# EAGLE design Main Board (EAGLE 9.3.1)
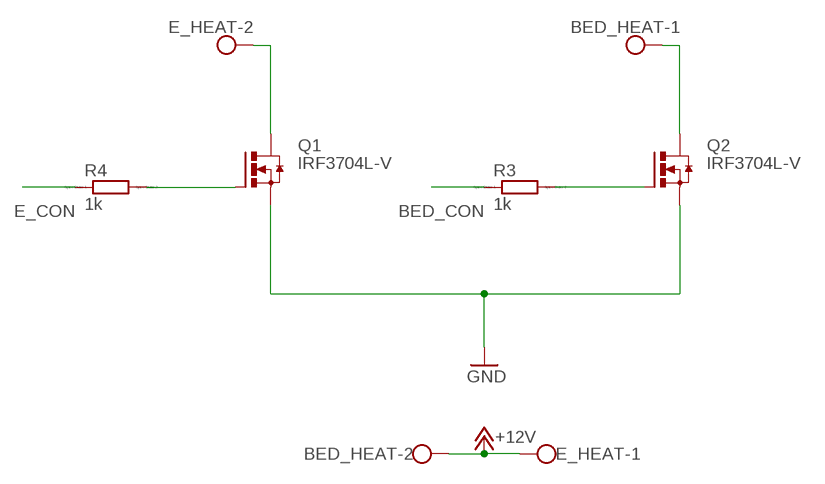
[diagram p0: schematic, sheet 1, part 1 of 2]
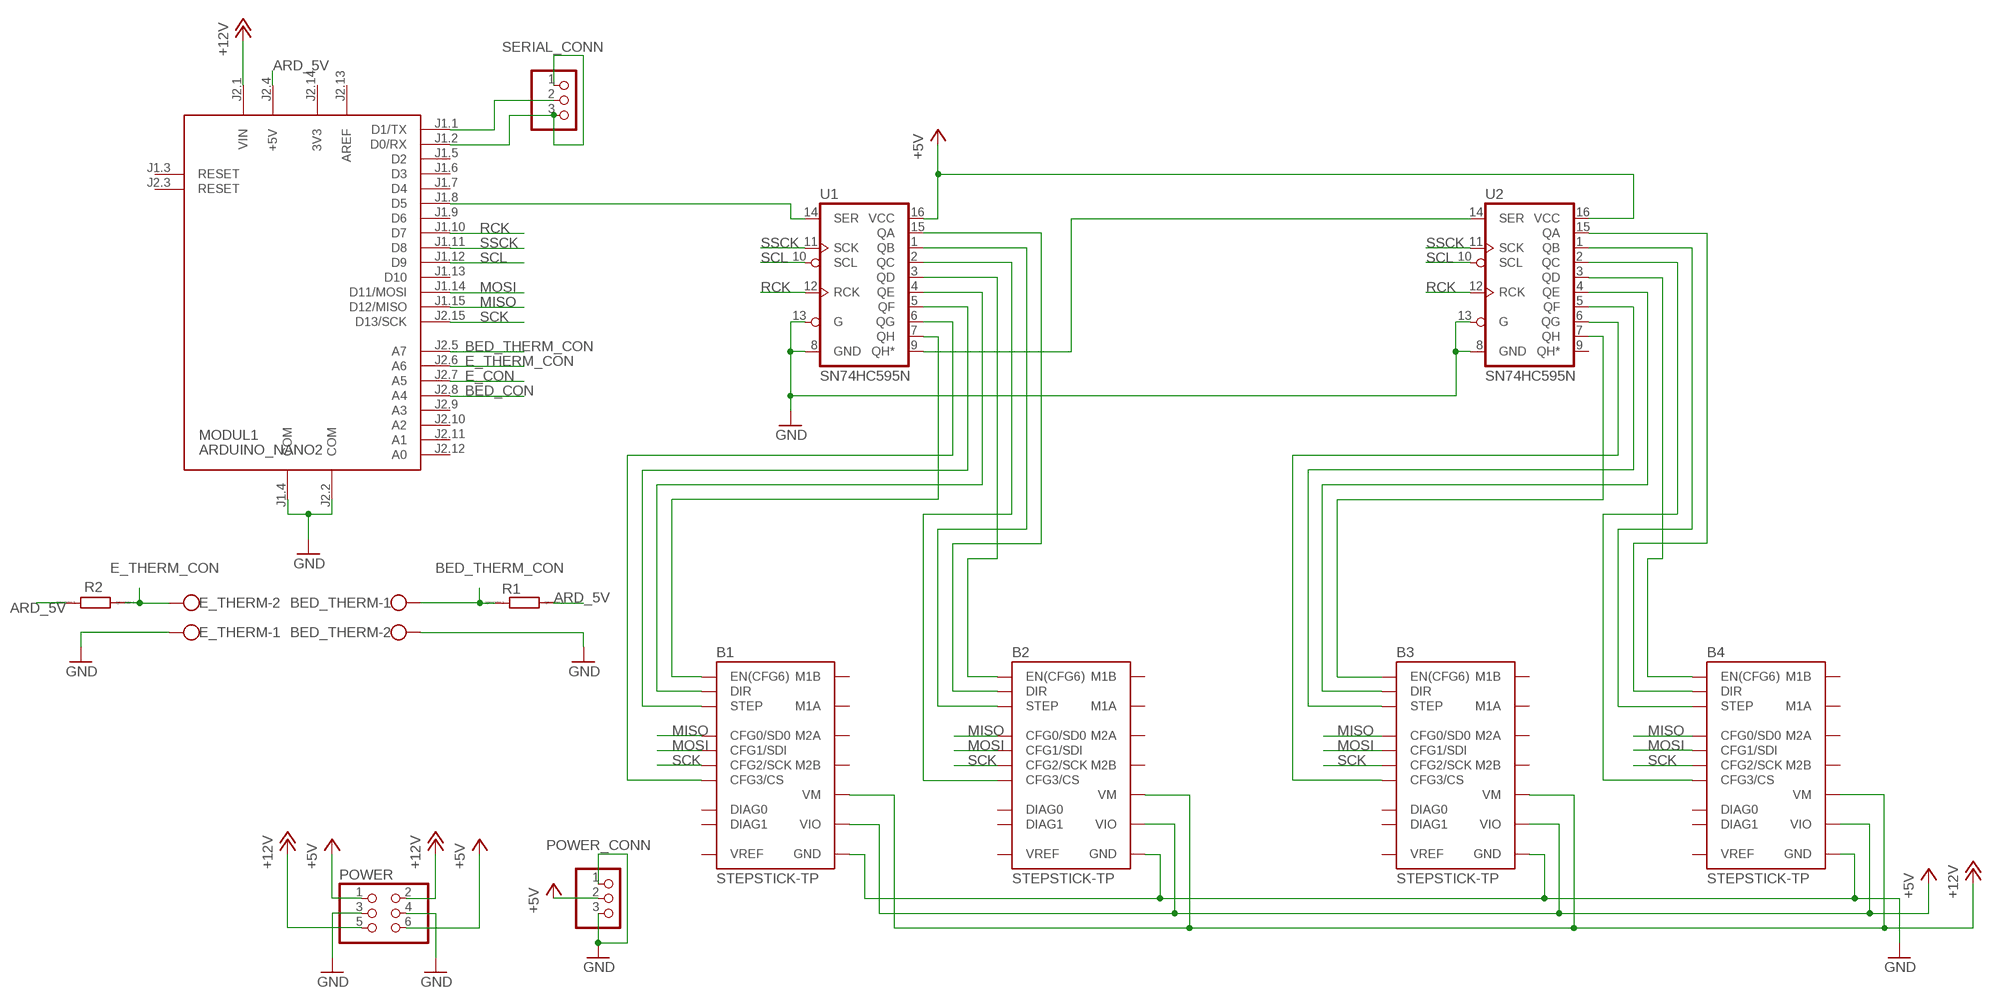
[diagram p1: schematic, sheet 1, part 2 of 2]

## Parts
B1  STEPSTICK-TP  [STEPSTICK_TP]
B2  STEPSTICK-TP  [STEPSTICK_TP]
B3  STEPSTICK-TP  [STEPSTICK_TP]
B4  STEPSTICK-TP  [STEPSTICK_TP]
BED_HEAT  W237-102  [W237-102]
BED_THERM  W237-102  [W237-102]
E_HEAT  W237-102  [W237-102]
E_THERM  W237-102  [W237-102]
MODUL1  ARDUINO_NANO2  [ARDUINO_NANO2]
POWER  PINHD-2X3  [2X03]
POWER_CONN  PINHD-1X3  [1X03]
Q1  IRF3704L-V  [TO262-V]
Q2  IRF3704L-V  [TO262-V]
R1  R0204/7  [0204/7]
R2  R0204/7  [0204/7]
R3  1k  R0207/10  [0207/10]
R4  1k  R0207/10  [0207/10]
SERIAL_CONN  PINHD-1X3  [1X03]
U1  SN74HC595N  74HC595N  [DIP16]
U2  SN74HC595N  74HC595N  [DIP16]

## Nets
+5V: B1.VIO B2.VIO B3.VIO B4.VIO POWER.1 POWER.6 POWER_CONN.2 U1.16(VCC) U2.16(VCC)
+12V: B1.VM B2.VM B3.VM B4.VM BED_HEAT.2 E_HEAT.1 MODUL1.J2.1(VIN) POWER.2 POWER.5
ARD_5V: MODUL1.J2.4(+5V) R1.2 R2.2
BED_CON: MODUL1.J2.8(A4) R3.1
BED_THERM_CON: BED_THERM.1 MODUL1.J2.5(A7) R1.1
E_CON: MODUL1.J2.7(A5) R4.1
E_THERM_CON: E_THERM.2 MODUL1.J2.6(A6) R2.1
GND: B1.GND@1(GND) B1.GND@2(GND) B2.GND@1(GND) B2.GND@2(GND) B3.GND@1(GND) B3.GND@2(GND) B4.GND@1(GND) B4.GND@2(GND) BED_THERM.2 E_THERM.1 MODUL1.J1.4(COM) MODUL1.J2.2(COM) POWER.3 POWER.4 POWER_CONN.1 POWER_CONN.3 Q1.3(S) Q2.3(S) U1.8(GND) U1.13(G) U2.8(GND) U2.13(G)
MISO: B1.NC/CFG0(CFG0/SD0) B2.NC/CFG0(CFG0/SD0) B3.NC/CFG0(CFG0/SD0) B4.NC/CFG0(CFG0/SD0) MODUL1.J1.15(D12/MISO)
MOSI: B1.CFG1(CFG1/SDI) B2.CFG1(CFG1/SDI) B3.CFG1(CFG1/SDI) B4.CFG1(CFG1/SDI) MODUL1.J1.14(D11/MOSI)
N$1 [Data]: MODUL1.J1.1(D1/TX) SERIAL_CONN.2
N$2: U1.9(QH*) U2.14(SER)
N$3: B2.CFG3(CFG3/CS) U1.2(QC)
N$4: E_HEAT.2 Q1.2(D)
N$5: Q2.1(G) R3.2
N$6: BED_HEAT.1 Q2.2(D)
N$7: Q1.1(G) R4.2
N$11: B3.EN(EN(CFG6)) U2.7(QH)
N$13: B3.STEP U2.5(QF)
N$15: B3.CFG3(CFG3/CS) U2.6(QG)
N$16: B4.CFG3(CFG3/CS) U2.2(QC)
N$18: B4.DIR U2.15(QA)
N$20: B1.DIR U1.4(QE)
N$21: B1.STEP U1.5(QF)
N$22 [Data]: MODUL1.J1.8(D5) U1.14(SER)
N$23: B1.CFG3(CFG3/CS) U1.6(QG)
N$24: B2.STEP U1.1(QB)
N$25: B2.DIR U1.15(QA)
N$26: B2.EN(EN(CFG6)) U1.3(QD)
N$27 [Data]: MODUL1.J1.2(D0/RX) SERIAL_CONN.1 SERIAL_CONN.3
N$28 [Data]: B1.EN(EN(CFG6)) U1.7(QH)
N$30: B3.DIR U2.4(QE)
N$33: B4.EN(EN(CFG6)) U2.3(QD)
N$35: B4.STEP U2.1(QB)
RCK: MODUL1.J1.10(D7) U1.12(RCK) U2.12(RCK)
SCK: B1.CFG2(CFG2/SCK) B2.CFG2(CFG2/SCK) B3.CFG2(CFG2/SCK) B4.CFG2(CFG2/SCK) MODUL1.J2.15(D13/SCK)
SCL: MODUL1.J1.12(D9) U1.10(SCL) U2.10(SCL)
SSCK: MODUL1.J1.11(D8) U1.11(SCK) U2.11(SCK)
Unconnected: B1.DIAG0 B1.DIAG1 B1.M1A B1.M1B B1.M2A B1.M2B B1.VREF B2.DIAG0 B2.DIAG1 B2.M1A B2.M1B B2.M2A B2.M2B B2.VREF B3.DIAG0 B3.DIAG1 B3.M1A B3.M1B B3.M2A B3.M2B B3.VREF B4.DIAG0 B4.DIAG1 B4.M1A B4.M1B B4.M2A B4.M2B B4.VREF MODUL1.J1.3(RESET) MODUL1.J1.5(D2) MODUL1.J1.6(D3) MODUL1.J1.7(D4) MODUL1.J1.9(D6) MODUL1.J1.13(D10) MODUL1.J2.3(RESET) MODUL1.J2.9(A3) MODUL1.J2.10(A2) MODUL1.J2.11(A1) MODUL1.J2.12(A0) U2.9(QH*)

## Power pins joined to a net without a drawn wire
3V3: MODUL1.J2.14(3V3)
AREF: MODUL1.J2.13(AREF)

## Library data of the parts
B1-B4 = we-board:STEPSTICK: SilentStepStick - Trinamic TMC2100/TMC2130 Stepper Motor Driver TMC2100 - CFG pins for configuration TMC2130 - SPI for configuration Pin CFG0/SDO only available on TMC2130 SilentStepStick.
BED_HEAT BED_THERM E_HEAT E_THERM = con-wago-500:W237-102: WAGO SCREW CLAMP; MPN: 237-102; OC_FARNELL: unknown; OC_NEWARK: 70K9898
MODUL1 = arduinoNano:ARDUINO_NANO2: Arduino Nano2 Auto generated by modulcreator.ulp \;; ANZAHL: 2; MODUL: TRUE; STECKX0: -76200; STECKX1: 76200; STECKY0: 177800; STECKY1: 177800
POWER = pinhead:PINHD-2X3: PIN HEADER
POWER_CONN SERIAL_CONN = pinhead:PINHD-1X3: PIN HEADER
Q1 Q2 = transistor-power:IRF3704: SMPS MOSFET HEXFET® Power MOSFET Source: http://www.irf.com/product-info/datasheets/data/irf3704.pdf
R1-R4 = eagle-ltspice:R: RESISTOR, European symbol; SPICEMODEL: NONE; SPICEPREFIX: R
U1 U2 = SparkFun-IC-Logic:74*595: 8-Bit Shift Register (Serial to Parallel) Datasheet <http://cdn.sparkfun.com/datasheets/BreakoutBoards/MM74HC595.pdf> SparkFun Products SparkFun Shift Register Breakout - 74HC595 <https://www.sparkfun.com/products/10680> (BOB-10680); PROD_ID: IC-13123

## Net classes
0 default: width 0.254 mm
1 Data: width 0.025 mm

## Board
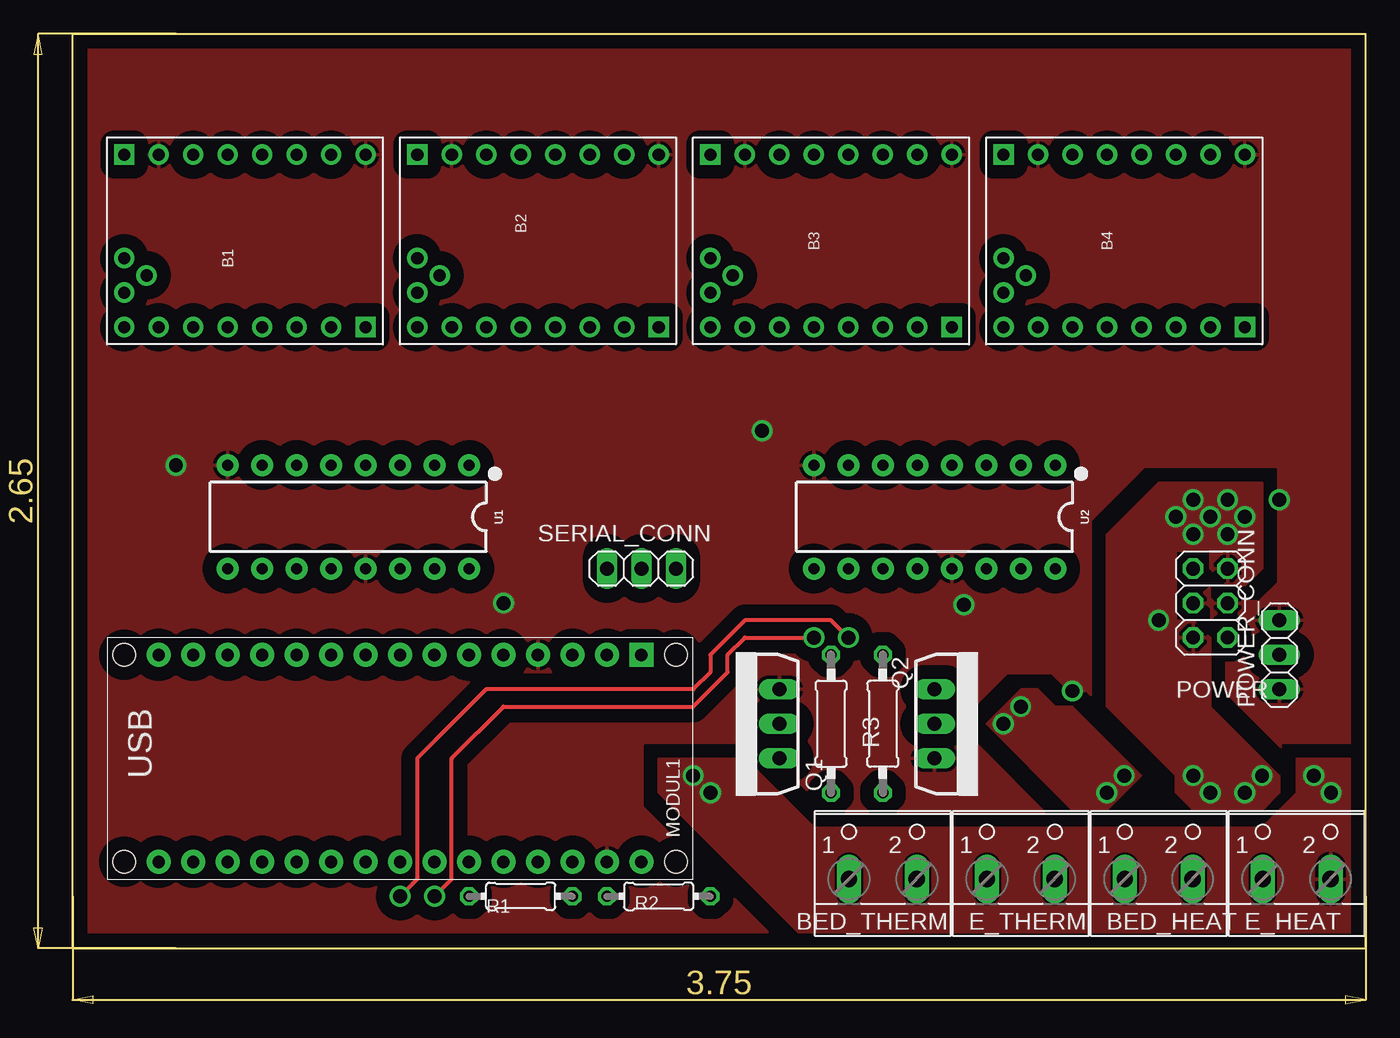
[diagram p2: board, top side]
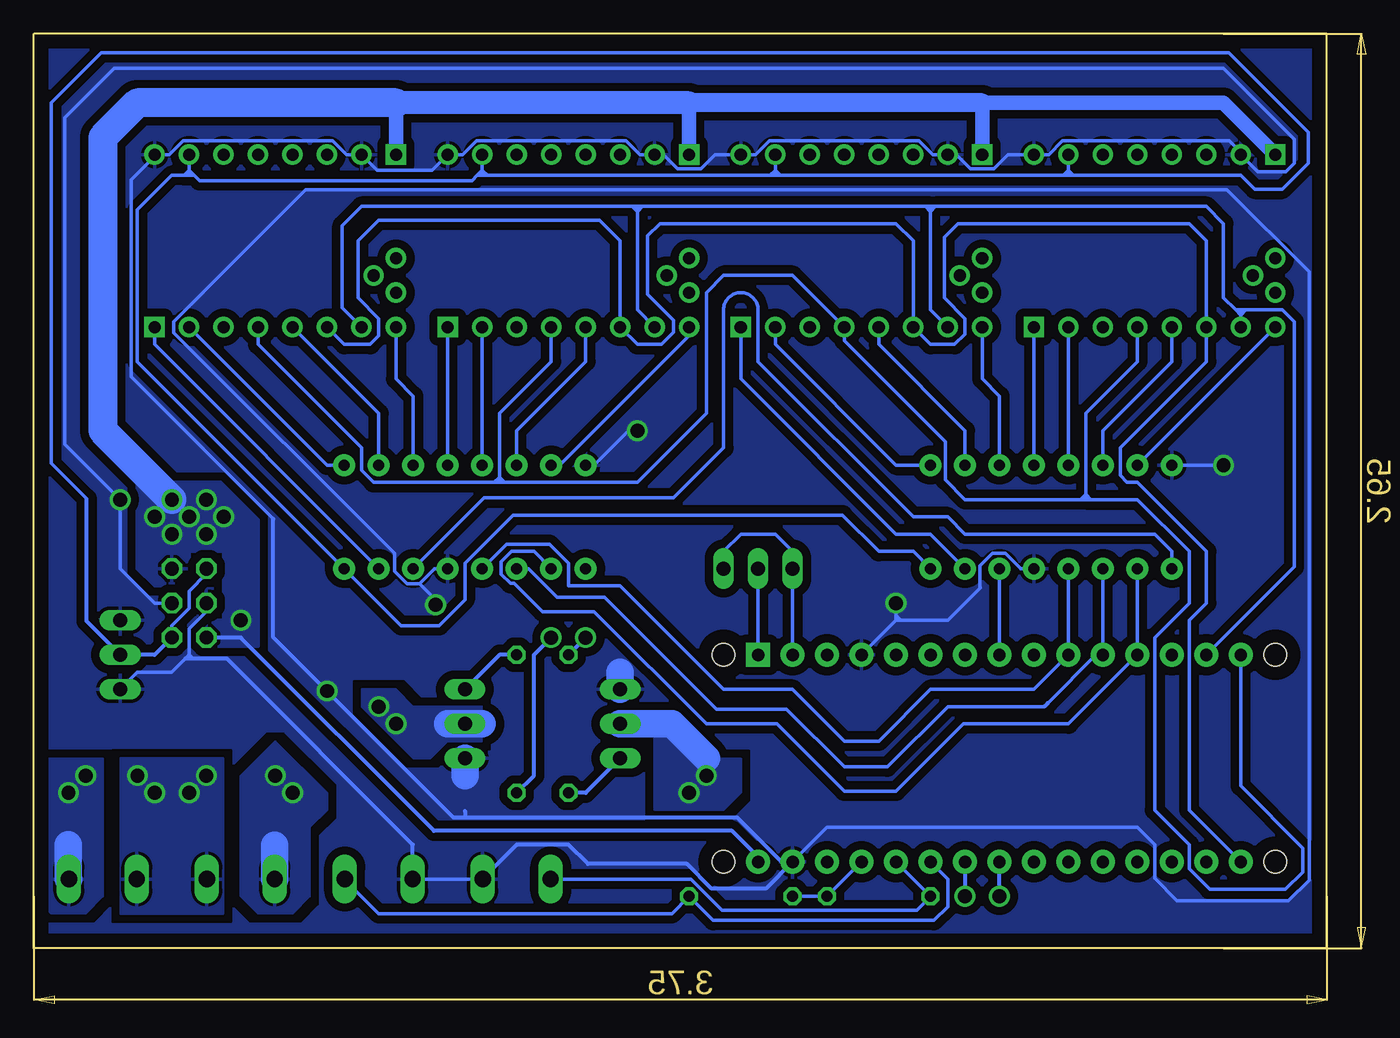
[diagram p3: board, bottom side, seen from below]

Size 95.25 x 67.31 mm. Coordinates in mm from the lower left corner, seen from the top.
Outline: 0,0 95.25,0 95.25,67.31 0,67.31 0,0
Copper layers (1*16): Top 0.035mm / dielectric 1.5mm / Bottom 0.035mm
Design rules "default": minimum track width 6mil, minimum drill 0.35mm, track to track 6mil, track to pad 6mil, pad to pad 6mil, via to via 6mil, smd to smd 6mil, copper to edge 40mil, drill to drill 6mil, minimum pad ring 10mil, minimum via ring 8mil, stop-mask expansion 4mil, vias tented up to drill 0mil, thermal gap 10mil

### Footprints (pad centres in the part's own frame; a part is rotated, then mirrored left to right if it is on the bottom)
STEPSTICK_TP = drill 0.9 pad 1.5: CFG1 -6.35,6.35; CFG2 -6.35,3.81; CFG3 -6.35,1.27; DIAG0 -2.54,7.239; DIAG1 -1.27,8.89; EN -6.35,8.89; GND@1 6.35,6.35; GND@2 6.35,-8.89; M1A 6.35,-1.27; M1B 6.35,-3.81; M2A 6.35,1.27; M2B 6.35,3.81; NC -6.35,-3.81; NC/CFG0 -6.35,-1.27; STEP -6.35,-6.35; VIO 6.35,-6.35; VREF -3.81,8.89 | drill 0.9 pad 1.5 square: DIR -6.35,-8.89; VM 6.35,8.89
W237-102 = drill 1.194 long: 1 -2.5,-1.27; 2 2.5,-1.27
ARDUINO_NANO2 = drill 0.914 pad 1.778 square: J1.1 -7.62,17.78 | drill 0.914 pad 1.778: J1.2 -7.62,15.24; J1.3 -7.62,12.7; J1.4 -7.62,10.16; J1.5 -7.62,7.62; J1.6 -7.62,5.08; J1.7 -7.62,2.54; J1.8 -7.62,0; J1.9 -7.62,-2.54; J1.10 -7.62,-5.08; J1.11 -7.62,-7.62; J1.12 -7.62,-10.16; J1.13 -7.62,-12.7; J1.14 -7.62,-15.24; J1.15 -7.62,-17.78; J2.1 7.62,17.78; J2.2 7.62,15.24; J2.3 7.62,12.7; J2.4 7.62,10.16; J2.5 7.62,7.62; J2.6 7.62,5.08; J2.7 7.62,2.54; J2.8 7.62,0; J2.9 7.62,-2.54; J2.10 7.62,-5.08; J2.11 7.62,-7.62; J2.12 7.62,-10.16; J2.13 7.62,-12.7; J2.14 7.62,-15.24; J2.15 7.62,-17.78 | hole 1.651: -7.62,-20.32; 7.62,-20.32; 7.62,20.32; -7.62,20.32
2X03 = drill 1.016 octagon: 1 -2.54,-1.27; 2 -2.54,1.27; 3 0,-1.27; 4 0,1.27; 5 2.54,-1.27; 6 2.54,1.27
1X03 = drill 1.016 long: 1 -2.54,0; 2 0,0; 3 2.54,0
TO262-V = drill 1.016 long: 1 -2.54,0; 2 0,0; 3 2.54,0
0204/7 = drill 0.813 octagon: 1 -3.81,0; 2 3.81,0
0207/10 = drill 0.813 octagon: 1 -5.08,0; 2 5.08,0
DIP16 = drill 0.813 pad 1.626: 1 -8.89,-3.81; 2 -6.35,-3.81; 3 -3.81,-3.81; 4 -1.27,-3.81; 5 1.27,-3.81; 6 3.81,-3.81; 7 6.35,-3.81; 8 8.89,-3.81; 9 8.89,3.81; 10 6.35,3.81; 11 3.81,3.81; 12 1.27,3.81; 13 -1.27,3.81; 14 -3.81,3.81; 15 -6.35,3.81; 16 -8.89,3.81

### Placement (x,y rotation side)
B1  12.7,52.07 90 top
B2  34.29,52.07 90 top
B3  55.88,52.07 90 top
B4  77.47,52.07 90 top
BED_HEAT  80.01,6.35 0 top
BED_THERM  59.69,6.35 0 top
E_HEAT  90.17,6.35 0 top
E_THERM  69.85,6.35 0 top
MODUL1  24.13,13.97 270 top
POWER  83.82,25.4 270 top
POWER_CONN  88.9,21.59 90 top
Q1  52.07,16.51 90 top
Q2  63.5,16.51 270 top
R1  33.02,3.81 0 top
R2  43.18,3.81 180 top
R3  59.69,16.51 90 top
R4  55.88,16.51 270 top
SERIAL_CONN  41.91,27.94 180 top
U1  20.32,31.75 180 top
U2  63.5,31.75 180 top

### Tracks (layer width: path | path; a pad name or v marks a point on that pad's centre or on a via)
+5V
  Bottom 0.254: POWER.6 85.09,23.75 83.82,25.02 83.82,26.29 82.55,27.56 POWER.1 | 62.61,56.9 62.23,56.9 | 62.23,56.9 61.85,56.9 | 61.85,56.9 41.02,56.9 | 41.02,56.9 40.64,56.9 | 40.64,56.9 40.26,56.9 | 40.26,56.9 19.43,56.9 | 19.43,56.9 19.05,56.9 | 19.05,56.9 18.67,56.9 | 18.67,56.9 6.35,56.9 5.33,55.88 3.3,55.88 1.4,57.78 1.4,60.07 7.24,65.91 90.3,65.91 93.98,62.23 93.98,35.69 91.38,33.08 | B1.VIO 19.05,57.28 | 19.05,57.28 19.05,56.9 | B2.VIO 40.64,57.28 | 40.64,57.28 40.64,56.9 | B3.VIO 62.23,57.28 | 62.23,57.28 62.23,56.9 | 19.05,57.28 18.67,56.9 | 19.05,57.28 19.43,56.9 | 40.64,57.28 40.26,56.9 | 40.64,57.28 41.02,56.9 | 62.23,57.28 61.85,56.9 | 62.23,57.28 62.61,56.9 | 62.61,56.9 62.99,56.52 83.06,56.52 83.44,56.9 | 83.44,56.9 83.82,56.9 | 83.82,56.9 84.2,56.9 | 84.2,56.9 85.09,56.9 87.63,54.36 87.63,43.18 U2.16 68.2,23.75 65.41,23.75 63.5,25.65 63.5,28.32 59.94,31.88 35.69,31.88 33.02,29.21 30.48,29.21 U1.16 | B4.VIO 83.82,57.28 | 83.82,57.28 83.82,56.9 | 83.82,57.28 83.44,56.9 | 83.82,57.28 84.2,56.9
  Bottom 0.305: POWER.6 86.36,21.59 POWER_CONN.2 91.38,24.07 91.38,33.08
+12V  (via drill 1.02, 1.02 pad 1.02)
  Bottom 0.305: MODUL1.J2.1 41.91,6.73 43.81,8.64 65.79,8.64 80.01,22.86 POWER.5
  Bottom 1.067: B1.VM 7.62,62.23 25.4,62.23 B2.VM | B4.VM 68.58,62.23 | B3.VM 46.99,62.23
  Bottom 1.397: 25.4,62.23 46.99,62.23
  Bottom 1.702: 46.99,62.23 68.58,62.23
  Bottom 2.134: 68.58,62.23 87.63,62.23 90.17,59.69 90.17,38.1 v85.09,33.02
  other vias: 83.82,31.75 81.28,31.75 85.09,30.48 82.55,33.02 86.36,31.75 80.01,24.13 82.55,30.48 82.55,12.7 83.82,11.43 86.36,11.43 87.63,12.7
  pour Bottom (isolate 0.61): 81.28,34.29 87.63,34.29 87.63,27.94 86.36,26.67 85.09,26.67 83.82,27.94 83.82,29.21 81.28,29.21 81.28,24.13 82.55,24.13 82.55,22.86 81.92,22.23 78.74,22.23 78.74,31.75
  pour Top: 80.01,34.29 87.63,34.29 87.63,27.94 86.36,26.67 85.09,26.67 83.82,27.94 83.82,29.21 81.28,29.21 81.28,24.13 82.55,24.13 83.82,22.86 83.82,17.78 88.9,12.7 88.9,11.43 87.63,10.16 82.55,10.16 81.28,11.43 81.28,12.7 76.2,17.78 76.2,30.48
  pour Bottom: 81.28,2.54 81.28,13.97 88.9,13.97 88.9,2.54
ARD_5V
  Bottom 0.254: MODUL1.J2.4 R1.2 R2.2
BED_CON  (via drill 1.02)
  Top 0.305: v57.15,22.86 55.88,24.13 49.53,24.13 46.99,21.59 46.99,20.32 45.72,19.05 30.48,19.05 25.4,13.97 25.4,5.08 v24.13,3.81
  Bottom 0.305: R3.1 58.42,12.7 58.42,21.59 v57.15,22.86 | v24.13,3.81 MODUL1.J2.8
BED_THERM_CON
  Bottom 0.254: MODUL1.J2.5 R1.1 30.23,2.79 44.58,2.79 46.86,5.08 BED_THERM.1
E_CON  (via drill 1.02)
  Top 0.305: v26.67,3.81 27.94,5.08 27.94,13.97 31.75,17.78 45.72,17.78 48.26,20.32 48.26,21.59 49.53,22.86 v54.61,22.86
  Bottom 0.305: MODUL1.J2.7 v26.67,3.81 | v54.61,22.86 R4.1
E_THERM_CON
  Bottom 0.254: MODUL1.J2.6 27.94,5.08 27.94,3.05 28.96,2.03 45.21,2.03 R2.1 48.26,2.54 69.85,2.54 72.35,5.04 E_THERM.2
GND  (via drill 1.02, 1.02 pad 1.02)
  Bottom 0.254: POWER.3 82.55,24.77 83.82,23.5 83.82,21.59 84.07,21.34 85.09,20.32 87.63,20.32 POWER_CONN.1 88.9,19.15 | U1.13 22.55,27.94 23.67,29.06 24.66,29.06 25.58,28.14 25.58,26.59 25.53,26.54 27.94,24.13 31.37,24.13 | U2.13 65.73,27.94 66.84,26.84 | 66.84,26.84 66.85,26.82 67.77,26.82 68.68,27.74 68.68,29.06 84.94,45.31 84.94,46.13 75.23,55.83 7.37,55.83 1.32,49.78 1.32,5 2.85,3.48 11.05,3.48 12.7,5.13 12.7,7.62 13.97,8.89 36.83,8.89 MODUL1.J2.2 39.83,5.99 | U1.8 v7.62,35.56 | 31.75,24.13 v31.75,25.4 31.75,24.51 31.37,24.13 | 66.84,26.84 65.66,25.65 v65.66,25.27 | U2.8 53.98,35.56 51.44,38.1 v50.8,38.1 | 31.75,24.13 MODUL1.J1.4 | 31.37,24.13 31.75,24.13 | 59.69,7.62 59.69,7.58 | BED_THERM.2 62.23,5.08 E_THERM.1 | POWER.4 86.36,25.4 88.9,27.94 v88.9,33.02 92.96,37.08 92.96,61.15 89.34,64.77 7.62,64.77 2.41,59.56 2.41,57.78 3.05,57.15 5.08,57.15 B1.GND@1 6.35,58.61 7.19,59.45 19.48,59.45 20.51,58.42 B1.GND@2 23.5,58.42 24.53,57.39 26.27,57.39 27.3,58.42 B2.GND@1 29.02,58.42 30.05,59.45 41.07,59.45 42.1,58.42 B2.GND@2 45.09,58.42 46.12,57.39 47.86,57.39 48.88,58.42 B3.GND@1 50.61,58.42 51.64,59.45 62.66,59.45 63.69,58.42 B3.GND@2 65.91,57.28 69.98,57.28 B4.GND@1 72.2,58.42 73.23,59.45 84.25,59.45 85.28,58.42 B4.GND@2 86.36,58.32 88.09,56.59 88.09,42.06 77.62,31.6
  Bottom 0.305: MODUL1.J2.2 41.34,4.38 45.34,4.38 47.15,6.19 54.45,6.19 55.88,7.62 59.69,7.62 | 39.83,5.99 43.43,9.6 63.5,9.6 | 59.69,7.58 59.73,7.58 62.23,5.08 | E_THERM.1 67.35,7.62 81.07,21.34 83.61,21.34 | 83.61,21.34 83.82,21.55 83.82,21.59 | 84.07,21.34 83.61,21.34 | 63.5,9.6 64.34,9.6 v73.66,18.92 77.62,22.89 77.62,31.6 | 63.5,10.11 63.5,9.6
  Bottom 2.032: Q1.3 52.07,20.32 | Q2.3 63.5,12.7
  pour Top (isolate 1.016, rank 2): 0,67.31 95.25,67.31 95.25,0 0,0
  pour Bottom (isolate 0.61, rank 2): 0,67.31 95.25,67.31 95.25,0 0,0
MISO
  Bottom 0.254: B1.NC/CFG0 13.97,43.18 17.78,39.37 17.78,33.4 | 17.78,33.02 17.4,33.02 | 17.4,33.02 13.97,33.02 10.16,29.21 10.16,25.4 12.7,22.86 12.7,10.16 10.16,7.62 10.16,5.84 8.64,4.32 3.06,4.32 1.78,5.6 1.78,7.37 6.35,11.94 MODUL1.J1.15 | 60.58,34.29 50.8,34.29 45.72,39.37 45.72,48.26 44.45,49.53 39.37,49.53 B2.NC/CFG0 35.56,44.73 28.12,37.28 28.12,34.47 26.67,33.02 18.16,33.02 | 60.58,34.29 60.96,34.29 | 60.96,34.29 60.96,34.67 | 60.96,34.67 60.96,39.37 57.15,43.18 B3.NC/CFG0 | B4.NC/CFG0 78.74,44.45 71.12,36.83 71.12,35.18 70.23,34.29 61.34,34.29 | 17.78,33.02 18.16,33.02 | 17.78,33.4 17.78,33.02 | 17.4,33.02 17.78,33.4 | 17.78,33.4 18.16,33.02 | 61.34,34.29 60.96,34.29 | 60.58,34.29 60.96,34.67 | 60.96,34.67 61.34,34.29
MOSI
  Bottom 0.254: B4.CFG1 72.53,47.13 72.53,53.2 71.12,54.61 51.18,54.61 | B3.CFG1 50.8,46.99 50.8,54.23 | B2.CFG1 29.21,46.99 29.21,54.61 | 6.35,46.61 B1.CFG1 6.35,46.99 | MODUL1.J1.14 2.41,28.07 2.41,46.1 3.3,46.99 6.35,46.99 | 29.21,54.61 29.59,54.61 | 29.59,54.61 50.42,54.61 | 50.42,54.61 50.8,54.61 | 50.8,54.61 50.8,54.23 | 50.8,54.61 51.18,54.61 | 29.21,54.61 28.83,54.61 | 28.83,54.61 8.89,54.61 7.62,53.34 7.62,47.88 6.73,46.99 | 28.83,54.61 29.21,54.23 29.59,54.61 | 50.42,54.61 50.8,54.23 | 50.8,54.23 51.18,54.61 | 6.73,46.99 6.35,46.61 | 6.35,46.61 5.97,46.99 | 6.35,46.99 6.73,46.99
N$1
  Bottom 0.254: SERIAL_CONN.2 MODUL1.J1.1
N$2
  Bottom 0.254: U1.9 11.43,29.21 12.7,30.48 26.67,30.48 27.94,31.75 30.48,31.75 41.91,43.18 41.91,46.99 arc-90 43.18,48.26 arc-90 44.45,46.99 44.45,36.83 48.13,33.15 62.1,33.15 U2.14
N$3
  Bottom 0.254: B2.CFG3 33.02,44.45 26.67,38.1 U1.2
N$4  (via drill 1.02)
  Bottom 2.032: 45.72,13.97 48.26,16.51 Q1.2 | E_HEAT.2 92.71,5.12 92.71,7.62
  other vias: 45.72,12.7 46.99,11.43 91.44,12.7 92.71,11.43
  pour Bottom: 44.45,10.16 49.53,10.16 49.53,16.51 47.41,16.51 45.72,13.97 43.18,13.97 43.18,11.43
  pour Top: 90.17,13.97 95.25,13.97 95.25,1.27 93.98,0 54.61,0 43.18,11.43 43.18,13.97 49.53,13.97 54.61,8.89 87.63,8.89 90.17,11.43
  pour Bottom: 90.17,13.97 90.17,3.81 91.44,2.54 93.98,2.54 95.25,3.81 95.25,13.97
N$5
  Bottom 0.305: Q2.1 60.96,21.59 R3.2
N$6  (via drill 1.02)
  Bottom 2.032: 64.77,16.51 Q2.2 62.23,16.51 | BED_HEAT.1 77.51,7.58
  other vias: 68.58,16.51 69.85,17.78 76.2,11.43 77.47,12.7
  pour Bottom: 62.23,17.78 67.31,17.78 68.58,19.05 71.12,19.05 71.12,17.78 67.31,13.97 66.04,13.97 64.77,15.24 62.23,15.24
  pour Bottom: 74.93,5.08 74.93,3.81 76.2,2.54 78.74,2.54 80.01,3.81 80.01,12.7 77.47,15.24 73.66,11.43 73.66,10.16 74.93,8.89
  pour Top: 67.31,16.51 73.66,10.16 76.2,10.16 78.74,12.7 73.66,17.78 72.39,17.78 71.12,19.05 69.85,19.05
N$7
  Bottom 0.305: Q1.1 54.61,11.43 R4.2
N$11
  Bottom 0.254: U2.7 56.52,35.56 46.99,45.09 B3.EN
N$13
  Bottom 0.254: B3.STEP U2.5
N$15
  Bottom 0.254: U2.6 59.69,38.1 54.61,43.18 B3.CFG3
N$16
  Bottom 0.254: B4.CFG3 69.85,39.37 U2.2
N$18
  Bottom 0.254: U2.15 86.36,44.45 B4.DIR
N$20
  Bottom 0.254: B1.DIR U1.4
N$21
  Bottom 0.254: B1.STEP U1.5
N$22
  Bottom 0.254: MODUL1.J1.8 U1.14
N$23
  Bottom 0.254: U1.6 16.51,38.1 11.43,43.18 B1.CFG3
N$24
  Bottom 0.254: B2.STEP 40.64,44.45 31.75,35.56 U1.1
N$25
  Bottom 0.254: B2.DIR 43.18,41.91 31.75,30.48 29.21,30.48 U1.15
N$26
  Bottom 0.254: B2.EN 25.4,41.91 24.13,40.64 U1.3
N$27
  Bottom 0.254: MODUL1.J1.2 SERIAL_CONN.3 39.37,29.21 40.64,30.48 43.18,30.48 44.45,29.21 SERIAL_CONN.1
N$28
  Bottom 0.254: U1.7 B1.EN
N$30
  Bottom 0.254: U2.4 B3.DIR
N$33
  Bottom 0.254: B4.EN 68.58,41.91 67.31,40.64 U2.3
N$35
  Bottom 0.254: U2.1 73.66,35.56 B4.STEP
RCK
  Bottom 0.254: U1.12 MODUL1.J1.10 21.59,19.05 29.21,19.05 33.02,15.24 35.56,15.24 39.37,19.05 44.45,19.05 52.07,26.67 55.88,26.67 55.88,28.32 57.28,29.72 60.45,29.72 U2.12
SCK
  Bottom 0.254: B4.CFG2 72.39,44.45 70.48,44.45 69.85,45.09 69.85,46.35 71.37,47.88 71.37,52.07 69.85,53.59 53.59,53.59 52.07,52.07 B3.CFG2 50.8,44.45 49.02,44.45 48.13,45.34 48.13,46.23 50.04,48.13 50.04,52.45 49.15,53.34 31.75,53.34 30.48,52.07 B2.CFG2 29.21,44.45 27.43,44.45 26.67,45.21 26.67,46.35 28.19,47.88 28.19,52.32 27.18,53.34 10.16,53.34 8.89,52.07 B1.CFG2 8.89,43.18 15.24,36.83 15.24,34.8 14.73,34.29 13.97,34.29 8.89,29.21 8.89,25.4 10.16,24.13 10.16,10.16 MODUL1.J2.15
SCL
  Bottom 0.254: U1.10 MODUL1.J1.12 19.05,16.51 26.8,16.51 31.75,11.56 35.56,11.56 40.51,16.51 45.72,16.51 53.98,24.77 57.78,24.77 59.87,26.85 60.14,26.85 60.83,27.54 60.83,28.45 60.07,29.21 58.42,29.21 U2.10
SSCK
  Bottom 0.254: U1.11 MODUL1.J1.11 17.02,21.59 20.57,18.03 | U2.11 58.8,27.94 56.71,25.84 53.21,25.84 44.96,17.59 39.81,17.59 35.56,13.34 32.38,13.34 27.94,17.78 20.83,17.78
  Bottom 0.305: 20.57,18.03 20.83,17.78

### Text on the board
tSilk: USB